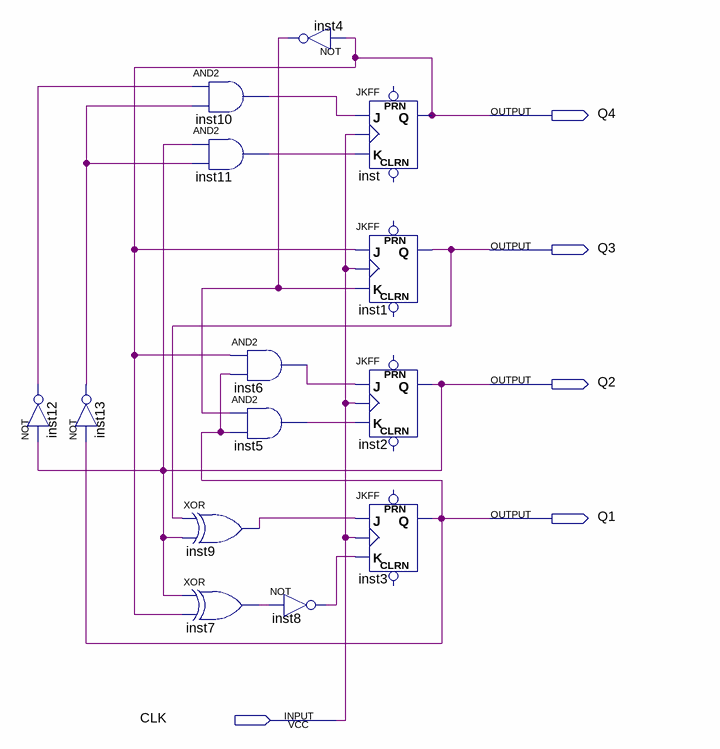
[diagram p0: schematic sheet]
// Quartus schematic Lab6.bdf as structural Verilog: 14 symbols, 5 pins
module Lab6 (
  input  CLK,
  output Q4,
  output Q3,
  output Q2,
  output Q1
);

  wire inst4_out, inst5_out, inst6_out, inst7_out, inst8_out, inst9_out, inst10_out, inst11_out, inst12_out,
       inst13_out;

  not inst12 (inst12_out, Q2);
  not inst13 (inst13_out, Q1);
  and inst10 (inst10_out, inst12_out, inst13_out);
  and inst11 (inst11_out, Q2, inst13_out);
  and inst6 (inst6_out, Q4, Q1);
  and inst5 (inst5_out, inst4_out, Q1);
  xor inst9 (inst9_out, Q3, Q2);
  xor inst7 (inst7_out, Q2, Q4);
  not inst4 (inst4_out, Q4);
  not inst8 (inst8_out, inst7_out);
  JKFF inst (.K(inst11_out), .J(inst10_out), .CLK(CLK), .Q(Q4));  // open: PRN, CLRN
  JKFF inst1 (.K(inst4_out), .J(Q4), .CLK(CLK), .Q(Q3));  // open: PRN, CLRN
  JKFF inst2 (.K(inst5_out), .J(inst6_out), .CLK(CLK), .Q(Q2));  // open: PRN, CLRN
  JKFF inst3 (.K(inst8_out), .J(inst9_out), .CLK(CLK), .Q(Q1));  // open: PRN, CLRN
endmodule
